# Altium schematic sheet Sheet1.SchDoc
size 381 x 241 mm; SheetNumber: 1; SheetTotal: 1
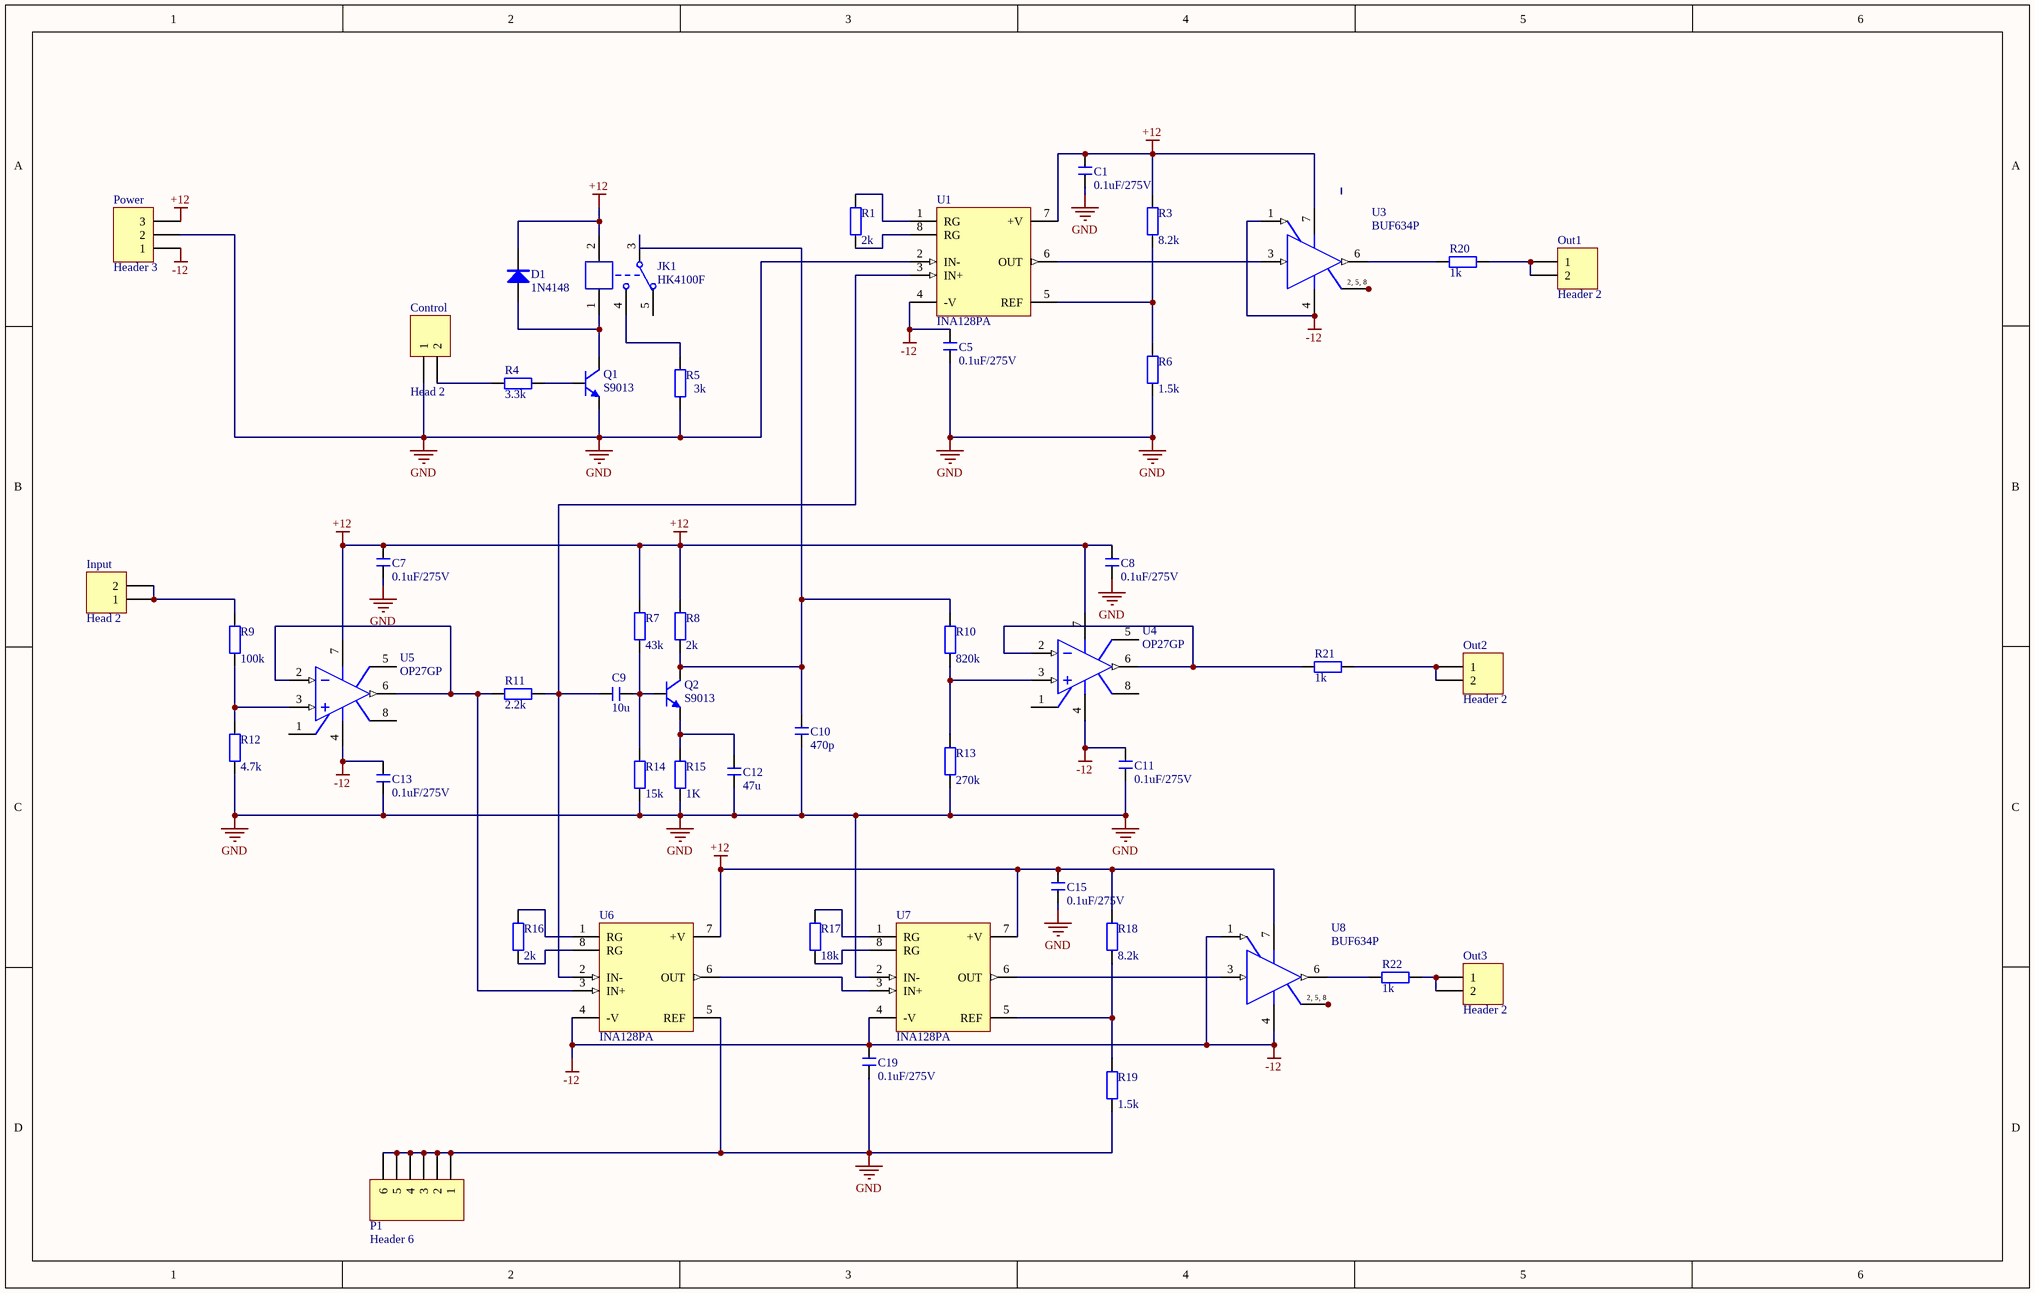
[diagram p0: Sheet1.SchDoc]

## Parts
C1  0.1uF/275V  [CBB-CL71]
C5  0.1uF/275V  [CBB-CL71]
C7  0.1uF/275V  [CBB-CL71]
C8  0.1uF/275V  [CBB-CL71]
C9  10u  [CBB-CL71]
C10  470p  [CBB-CL71]
C11  0.1uF/275V  [CBB-CL71]
C12  47u  [CBB-CL71]
C13  0.1uF/275V  [CBB-CL71]
C15  0.1uF/275V  [CBB-CL71]
C19  0.1uF/275V  [CBB-CL71]
Control  Head 2  [HDR1X2]
D1  1N4148  [DO-35]
Input  Head 2  [HDR1X2]
JK1  HK4100F  [HK4100F]
Out1  Header 2  [HDR1X2]
Out2  Header 2  [HDR1X2]
Out3  Header 2  [HDR1X2]
P1  Header 6  [HDR1X6]
Power  Header 3  [XH2.54-LI-3P]
Q1  S9013  [TO92]
Q2  S9013  [TO92]
R1  value 2k  [AXIAL-0.4]
R3  value 8.2k  [AXIAL-0.4]
R4  value 3.3k  [AXIAL-0.4]
R5  value 3k  [AXIAL-0.4]
R6  value 1.5k  [AXIAL-0.4]
R7  value 43k  [AXIAL-0.4]
R8  value 2k  [AXIAL-0.4]
R9  value 100k  [AXIAL-0.4]
R10  value 820k  [AXIAL-0.4]
R11  value 2.2k  [AXIAL-0.4]
R12  value 4.7k  [AXIAL-0.4]
R13  value 270k  [AXIAL-0.4]
R14  value 15k  [AXIAL-0.4]
R15  value 1K  [AXIAL-0.4]
R16  value 2k  [AXIAL-0.4]
R17  value 18k  [AXIAL-0.4]
R18  value 8.2k  [AXIAL-0.4]
R19  value 1.5k  [AXIAL-0.4]
R20  value 1k  [AXIAL-0.4]
R21  value 1k  [AXIAL-0.4]
R22  value 1k  [AXIAL-0.4]
U1  INA128PA  [006E]
U3  BUF634P  [006E]
U4  OP27GP  [N-8_A]
U5  OP27GP  [N-8_A]
U6  INA128PA  [006E]
U7  INA128PA  [006E]
U8  BUF634P  [006E]

## Nets
+12: C1.1 C7.1 C8.1 C15.1 D1.2(K) JK1.2 Power.3 R3.2 R7.2 R8.2 R18.2 U1.7(+V) U3.7(V+) U4.7(V+) U5.7(V+) U6.7(+V) U7.7(+V) U8.7(V+)
-12: C5.1 C11.1 C13.1 C19.1 Power.1 U1.4(-V) U3.1(BW) U3.4(V-) U4.4(V-) U5.4(V-) U6.4(-V) U7.4(-V) U8.1(BW) U8.4(V-)
GND: C1.2 C5.2 C7.2 C8.2 C10.1 C11.2 C12.1 C13.2 C15.2 C19.2 Control.1 P1.1 P1.2 P1.3 P1.4 P1.5 P1.6 Power.2 Q1.1(E) R5.1 R6.1 R12.1 R13.1 R14.1 R15.1 R19.1 U1.2(IN-) U6.5(REF) U7.2(IN-)
NetC9_1: C9.1 R11.1 U1.3(IN+) U6.2(IN-)
NetC9_2: C9.2 Q2.2(B) R7.1 R14.2
NetC10_2: C10.2 JK1.3 Q2.3(C) R8.1 R10.2
NetC12_2: C12.2 Q2.1(E) R15.2
NetControl_2: Control.2 R4.2
NetD1_1: D1.1(A) JK1.1 Q1.3(C)
NetInput_1: Input.1 Input.2 R9.2
NetJK1_4: JK1.4 R5.2
NetOut1_1: Out1.1 Out1.2 R20.1
NetOut2_1: Out2.1 Out2.2 R21.1
NetOut3_1: Out3.1 Out3.2 R22.1
NetQ1_2: Q1.2(B) R4.1
NetR1_1: R1.1 U1.8(RG)
NetR1_2: R1.2 U1.1(RG)
NetR3_1: R3.1 R6.2 U1.5(REF)
NetR9_1: R9.1 R12.2 U5.3(IN+)
NetR10_1: R10.1 R13.2 U4.3(IN+)
NetR11_2: R11.2 U5.2(IN-) U5.6(OUT) U6.3(IN+)
NetR16_1: R16.1 U6.8(RG)
NetR16_2: R16.2 U6.1(RG)
NetR17_1: R17.1 U7.8(RG)
NetR17_2: R17.2 U7.1(RG)
NetR18_1: R18.1 R19.2 U7.5(REF)
NetR20_2: R20.2 U3.6(OUT)
NetR21_2: R21.2 U4.2(IN-) U4.6(OUT)
NetR22_2: R22.2 U8.6(OUT)
NetU1_6: U1.6(OUT) U3.3(IN)
NetU3_2: U3.2(NC) U3.5(NC) U3.8(NC)
NetU6_6: U6.6(OUT) U7.3(IN+)
NetU7_6: U7.6(OUT) U8.3(IN)
NetU8_2: U8.2(NC) U8.5(NC) U8.8(NC)

Not connected (* = marked no-connect by the designer): JK1 5; U4 1(CMPEN) 5(NC) 8(CMPEN); U5 1(CMPEN) 5(NC) 8(CMPEN)

## Notes on the sheet
- (in symbol BUF634P) 2, 5, 8

## Library data of the parts
C1 C5 C7-C13 C15 C19 = C-CBB: CBB电容; 版权归属: 源创客; BOM名称: CBB电容; 学习资源: www.ooocke.com
Control Input Out1-Out3 = Header 2: Header, 2-Pin; LatestRevisionDate: 17-Jul-2002; LatestRevisionNote: Re-released for DXP Platform.; Publisher: Altium Limited
D1 = 1N4148: 高速开关二极管; 版权归属: 源创客; BOM名称: 高速开关二极管; 学习资源: www.ooocke.com
JK1 = HK4100F: 一组转换; BOM名称: 一组继电器; 版权归属: 源创客; 学习资源: www.ooocke.com
P1 = Header 6: Header, 6-Pin; LatestRevisionDate: 17-Jul-2002; LatestRevisionNote: Re-released for DXP Platform.; Publisher: Altium Limited
Power = Header 3: Header, 3-Pin; LatestRevisionDate: 17-Jul-2002; LatestRevisionNote: Re-released for DXP Platform.; Publisher: Altium Limited
Q1 Q2 = 9013-DIP: 低频放大-NPN型; 版权归属: 源创客; 属性: 50V 0.5A 0.625W; BOM名称: 低频放大-NPN型; 学习资源: www.ooocke.com
R1 R3-R22 = Res2: Resistor; Published: 8-Jun-2000; LatestRevisionDate: 17-Jul-2002; LatestRevisionNote: Re-released for DXP Platform.; PackageReference: AXIAL-0.4; Publisher: Altium Limited; PackageDescription: Axial Device, Thru-Hole; 2 Leads; 0.4 in Pin Spacing
U1 U6 U7 = INA128PA: Precision, Low-Power Instrumentation Amplifiers; Published: 8-Jun-2000; LatestRevisionDate: 06-Jun-2005; LatestRevisionNote: Stylized 3D Model Added.; DatasheetVersion: Oct-1996; PackageVersion: revE; PackageReference: 006E; Publisher: Altium Limited; PackageDescription: DIP; 8 Leads; Row Spacing 7.62 mm; Pitch 2.54 mm; ComponentLink1Description: Manufacturer Link; ComponentLink1URL: http://www.ti.com/; ComponentLink2Description: Datasheet; ComponentLink2URL: http://www-s.ti.com/sc/ds/INA128.pdf
U3 U8 = BUF634P: 250mA High-Speed Buffer; Note: Pins 2, 5 and 8 are No internal Connection (NC) pins.; Published: 8-Jun-2000; LatestRevisionDate: 06-Jun-2005; LatestRevisionNote: Stylized 3D Model Added.; DatasheetVersion: Jun-1996; PackageVersion: revE; PackageReference: 006E; Publisher: Altium Limited; PackageDescription: DIP; 8 Leads; Row Spacing 7.62 mm; Pitch 2.54 mm; ComponentLink1Description: Manufacturer Link; ComponentLink1URL: http://www.ti.com/; ComponentLink2Description: Datasheet; ComponentLink2URL: http://www-s.ti.com/sc/ds/BUF634.pdf
U4 U5 = OP27GP: Low-Noise, Precision Operational Amplifier; Note: Pin 5 is not connected.; Published: 8-Jun-2000; LatestRevisionDate: 04-Mar-2005; LatestRevisionNote: Stylized 3D Model Added.; DatasheetVersion: 1992; PackageReference: N-8_A; Publisher: Altium Limited; PackageDescription: DIP; 8 Leads; Row Spacing 7.62 mm; Pitch 2.54 mm; Code_JEDEC: MO-001-AN; ComponentLink1Description: Manufacturer Link; ComponentLink1URL: http://www.analog.com/en/prod/0,,759_786_OP27%2C00.html; ComponentLink2Description: Datasheet; ComponentLink2URL: http://www.analog.com/UploadedFiles/Data_Sheets/314538596OP27_c.pdf